# Altium schematic sheet MCU_ATmega328.SchDoc
size 203 x 152 mm
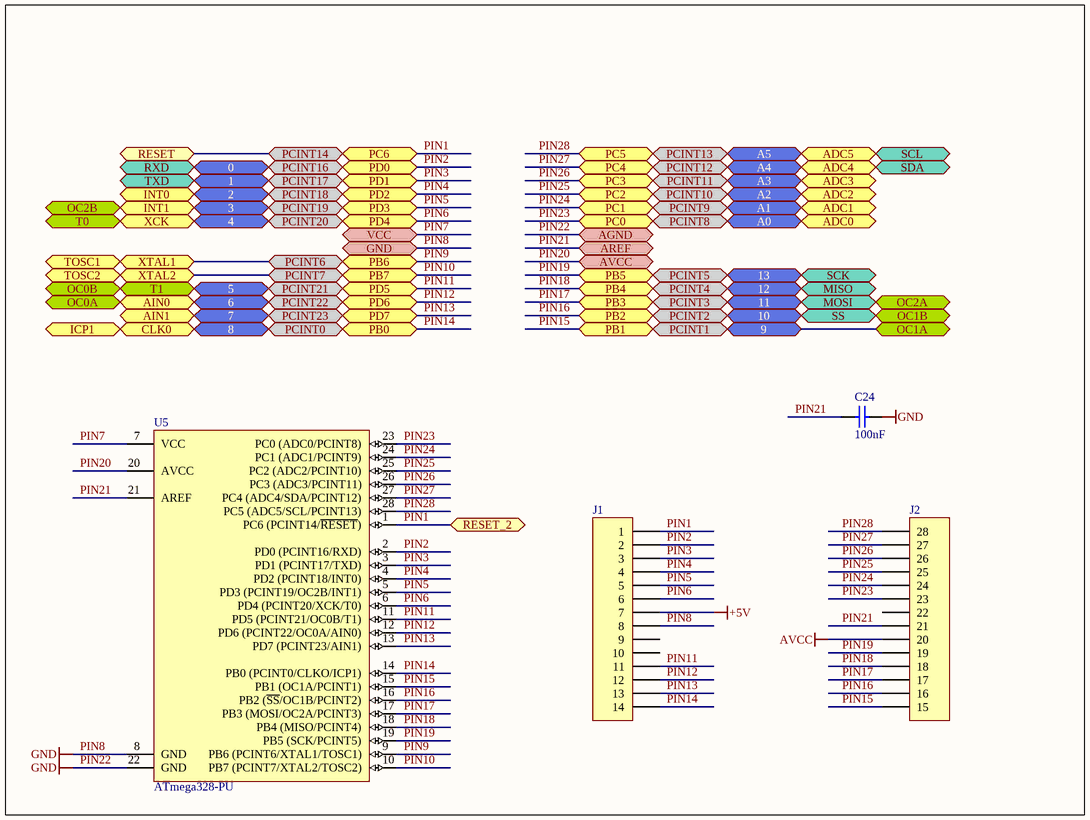
[diagram p0: MCU_ATmega328.SchDoc]

## Parts
C24  100nF  [0805]
J1  Header 14  [HDR1X14]  (value not drawn)
J2  14PIN  [HDR1X14_2]  (value not drawn)
U5  ATmega328-PU  [28P3]

## Ports
0 (bidir), 1 (bidir), 2 (bidir), 3 (bidir), 4 (bidir), 5 (bidir), 6 (bidir), 7 (bidir), 8 (bidir), 9 (bidir), 10 (bidir), 11 (bidir), 12 (bidir), 13 (bidir), A0 (bidir), A1 (bidir), A2 (bidir), A3 (bidir), A4 (bidir), A5 (bidir), ADC0 (bidir), ADC1 (bidir), ADC2 (bidir), ADC3 (bidir), ADC4 (bidir), ADC5 (bidir), AGND (bidir), AIN0 (bidir), AIN1 (bidir), AREF (bidir), AVCC (bidir), CLK0 (bidir), GND, ICP1 (bidir), INT0 (bidir), INT1 (bidir), MISO (bidir), MOSI (bidir), OC0A (bidir), OC0B (bidir), OC1A (bidir), OC1B (bidir), OC2A (bidir), OC2B (bidir), PB0 (bidir), PB1 (bidir), PB2 (bidir), PB3 (bidir), PB4 (bidir), PB5 (bidir), PB6 (bidir), PB7 (bidir), PC0 (bidir), PC1 (bidir), PC2 (bidir), PC3 (bidir), PC4 (bidir), PC5 (bidir), PC6 (bidir), PCINT0 (bidir), PCINT1 (bidir), PCINT2 (bidir), PCINT3 (bidir), PCINT4 (bidir), PCINT5 (bidir), PCINT6 (bidir), PCINT7 (bidir), PCINT8 (bidir), PCINT9 (bidir), PCINT10 (bidir), PCINT11 (bidir), PCINT12 (bidir), PCINT13 (bidir), PCINT14 (bidir), PCINT16 (bidir), PCINT17 (bidir), PCINT18 (bidir), PCINT19 (bidir), PCINT20 (bidir), PCINT21 (bidir), PCINT22 (bidir), PCINT23 (bidir), PD0 (bidir), PD1 (bidir), PD2 (bidir), PD3 (bidir), PD4 (bidir), PD5 (bidir), PD6 (bidir), PD7 (bidir), RESET (bidir), RESET_2 (bidir), RXD (bidir), SCK (bidir), SCL (bidir), SDA (bidir), SS (bidir), T0 (bidir), T1 (bidir), TOSC1 (bidir), TOSC2 (bidir), TXD (bidir), VCC, XCK (bidir), XTAL1 (bidir), XTAL2 (bidir)

## Nets
+5V: J1.7
AVCC: J2.20
PIN22: C24.1 J1.8 U5.8(GND) U5.22(GND) ; port GND, port AGND  [also labelled GND, PIN8]
PIN1: J1.1 U5.1(PC6_(PCINT14/~{RESET})) ; port RESET, port PC6, port PCINT14, port RESET_2
PIN2: J1.2 U5.2(PD0_(PCINT16/RXD)) ; port RXD, port PD0, port PCINT16, port 0
PIN3: J1.3 U5.3(PD1_(PCINT17/TXD)) ; port TXD, port PD1, port PCINT17, port 1
PIN4: J1.4 U5.4(PD2_(PCINT18/INT0)) ; port PD2, port PCINT18, port INT0, port 2
PIN5: J1.5 U5.5(PD3_(PCINT19/OC2B/INT1)) ; port PD3, port PCINT19, port INT1, port OC2B, port 3
PIN6: J1.6 U5.6(PD4_(PCINT20/XCK/T0)) ; port PD4, port PCINT20, port XCK, port T0, port 4
PIN7: U5.7(VCC) ; port VCC
PIN9: U5.9(PB6_(PCINT6/XTAL1/TOSC1)) ; port XTAL1, port TOSC1, port PB6, port PCINT6
PIN10: U5.10(PB7_(PCINT7/XTAL2/TOSC2)) ; port XTAL2, port TOSC2, port PB7, port PCINT7
PIN11: J1.11 U5.11(PD5_(PCINT21/OC0B/T1)) ; port PD5, port PCINT21, port T1, port OC0B, port 5
PIN12: J1.12 U5.12(PD6_(PCINT22/OC0A/AIN0)) ; port PD6, port PCINT22, port AIN0, port OC0A, port 6
PIN13: J1.13 U5.13(PD7_(PCINT23/AIN1)) ; port PD7, port PCINT23, port AIN1, port 7
PIN14: J1.14 U5.14(PB0_(PCINT0/CLKO/ICP1)) ; port PB0, port PCINT0, port CLK0, port ICP1, port 8
PIN15: J2.15 U5.15(PB1_(OC1A/PCINT1)) ; port PB1, port PCINT1, port OC1A, port 9
PIN16: J2.16 U5.16(PB2_(~{SS}/OC1B/PCINT2)) ; port PB2, port PCINT2, port OC1B, port SS, port 10
PIN17: J2.17 U5.17(PB3_(MOSI/OC2A/PCINT3)) ; port MOSI, port PB3, port PCINT3, port OC2A, port 11
PIN18: J2.18 U5.18(PB4_(MISO/PCINT4)) ; port MISO, port PB4, port PCINT4, port 12
PIN19: J2.19 U5.19(PB5_(SCK/PCINT5)) ; port SCK, port PB5, port PCINT5, port 13
PIN20: U5.20(AVCC) ; port AVCC
PIN21: C24.2 J2.21 U5.21(AREF) ; port AREF
PIN23: J2.23 U5.23(PC0_(ADC0/PCINT8)) ; port ADC0, port PC0, port PCINT8, port A0
PIN24: J2.24 U5.24(PC1_(ADC1/PCINT9)) ; port ADC1, port PC1, port PCINT9, port A1
PIN25: J2.25 U5.25(PC2_(ADC2/PCINT10)) ; port ADC2, port PC2, port PCINT10, port A2
PIN26: J2.26 U5.26(PC3_(ADC3/PCINT11)) ; port ADC3, port PC3, port PCINT11, port A3
PIN27: J2.27 U5.27(PC4_(ADC4/SDA/PCINT12)) ; port SDA, port ADC4, port PC4, port PCINT12, port A4
PIN28: J2.28 U5.28(PC5_(ADC5/SCL/PCINT13)) ; port SCL, port ADC5, port PC5, port PCINT13, port A5

Not connected (* = marked no-connect by the designer): J1 9 10; J2 22

## Library data of the parts
C24 = Cap: Capacitor; Manufacturer: Generic Components; Class I: Passive; Published: 8-Jun-2000; Revision: July-2002: Re-released for DXP Platform.; Publisher: Altium Limited; Class II: Capacitor
J1 = Header 14: Header, 14-Pin; Manufacturer: Generic Components; Class I: Connector; Revision: July-2002: Re-released for DXP Platform.; Publisher: Altium Limited
J2 = Header 14_2: Header, 14-Pin; Manufacturer: Generic Components; Class I: Connector; Revision: July-2002: Re-released for DXP Platform.; Publisher: Altium Limited
U5 = ATmega328-PU: 8-bit AVR Microcontroller, 32KB Flash, 1KB EEPROM, 2KB SRAM, 28-pin PDIP, Industrial Grade (-40°C to 85°C); Published: 1-Apr-2010; DatasheetVersion: revA, Jan-2010; PackageVersion: revB, Sep-2001; PackageReference: 28P3; Publisher: Altium Limited; PackageDescription: 28-lead (0.300"/7.62mm Wide) Plastic Dual Inline Package (PDIP); Supplier 1: Digi-Key; Supplier Part Number 1: ATMEGA328-PU-ND; Supplier 2: Mouser; Supplier Part Number 2: 556-ATMEGA328-PU; ComponentLink1Description: Manufacturer Link; ComponentLink1URL: http://www.atmel.com/products/avr/default.asp?; ComponentLink2Description: ATmega48A/48PA/88A/88PA/168A/168PA/328/328P Datasheet; ComponentLink2URL: http://www.atmel.com/dyn/resources/prod_documents/8271.pdf; ComponentLink3Description: ATmega48A/48PA/88A/88PA/168A/168PA/328/328P Summary; ComponentLink3URL: http://www.atmel.com/dyn/resources/prod_documents/8271S.pdf; ComponentLink4Description: Atmel.com Home; ComponentLink4URL: http://www.atmel.com